# EAGLE design FiLFO (EAGLE 5.11)

## Sheet 1 of 2
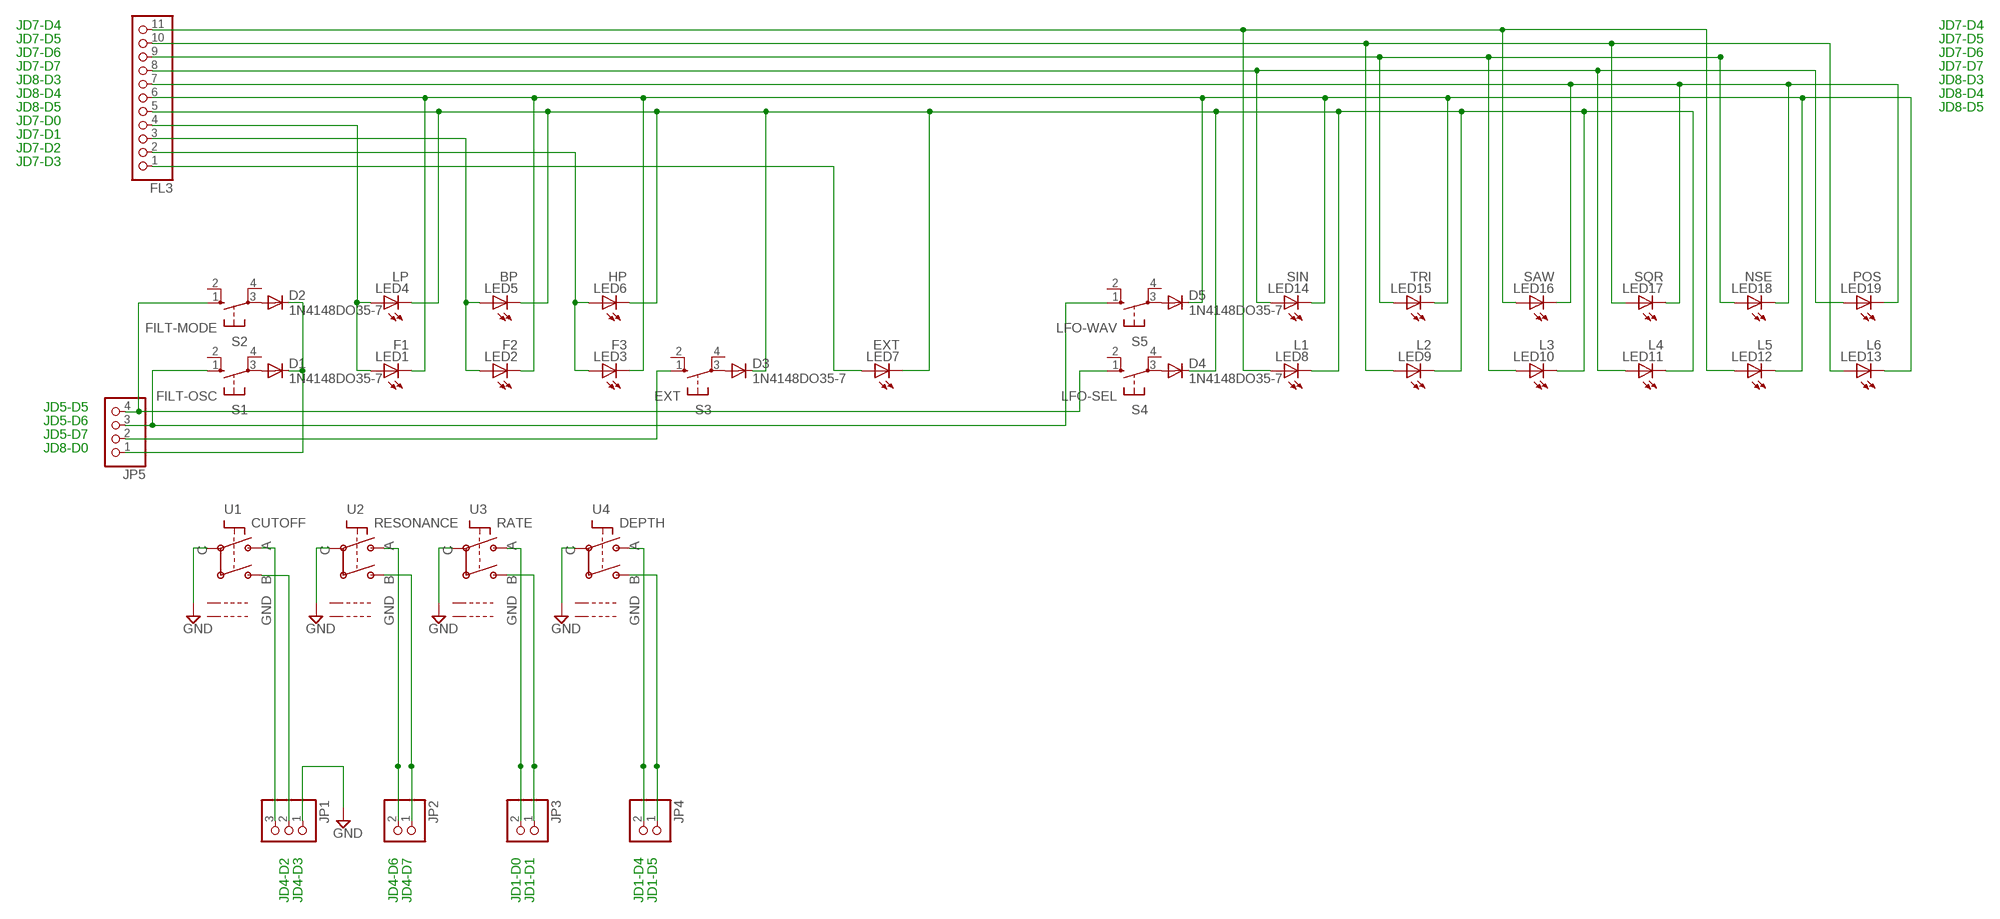
[diagram p0: schematic, sheet 1]

### Parts
D1  1N4148DO35-7  [DO35-7]
D2  1N4148DO35-7  [DO35-7]
D3  1N4148DO35-7  [DO35-7]
D4  1N4148DO35-7  [DO35-7]
D5  1N4148DO35-7  [DO35-7]
FL3  PINHD-1X11  [1X11]
JP1  PINHD-1X3  [1X03]
JP2  PINHD-1X2  [1X02]
JP3  PINHD-1X2  [1X02]
JP4  PINHD-1X2  [1X02]
JP5  PINHD-1X4  [1X04]
LED1  F1  LED3MM  [LED3MM]
LED2  F2  LED3MM  [LED3MM]
LED3  F3  LED3MM  [LED3MM]
LED4  LP  LED3MM  [LED3MM]
LED5  BP  LED3MM  [LED3MM]
LED6  HP  LED3MM  [LED3MM]
LED7  EXT  LED3MM  [LED3MM]
LED8  L1  LED3MM  [LED3MM]
LED9  L2  LED3MM  [LED3MM]
LED10  L3  LED3MM  [LED3MM]
LED11  L4  LED3MM  [LED3MM]
LED12  L5  LED3MM  [LED3MM]
LED13  L6  LED3MM  [LED3MM]
LED14  SIN  LED3MM  [LED3MM]
LED15  TRI  LED3MM  [LED3MM]
LED16  SAW  LED3MM  [LED3MM]
LED17  SQR  LED3MM  [LED3MM]
LED18  NSE  LED3MM  [LED3MM]
LED19  POS  LED3MM  [LED3MM]
S1  FILT-OSC  10-XX  [B3F-10XX]
S2  FILT-MODE  10-XX  [B3F-10XX]
S3  EXT  10-XX  [B3F-10XX]
S4  LFO-SEL  10-XX  [B3F-10XX]
S5  LFO-WAV  10-XX  [B3F-10XX]
U1  CUTOFF  ENC_ALPS_STEC16  [STEC16]
U2  RESONANCE  ENC_ALPS_STEC16  [STEC16]
U3  RATE  ENC_ALPS_STEC16  [STEC16]
U4  DEPTH  ENC_ALPS_STEC16  [STEC16]

### Nets
GND: JP1.1 U1.P$C U2.P$C U3.P$C U4.P$C
N$1: JP1.3 U1.P$A
N$2: JP1.2 U1.P$B
N$3: D2.A S2.3(P)
N$4: JP2.2 U2.P$A
N$5: JP2.1 U2.P$B
N$6: JP3.2 U3.P$A
N$7: JP3.1 U3.P$B
N$9: JP4.2 U4.P$A
N$10: JP4.1 U4.P$B
N$11: D1.A S1.3(P)
N$12: D4.A S4.3(P)
N$13: JP5.3 S1.1(S) S5.1(S)
N$14: D3.A S3.3(P)
N$15: JP5.4 S2.1(S) S4.1(S)
N$16: D1.C D2.C JP5.1
N$17: D5.C FL3.6 LED1.K(C) LED2.K(C) LED3.K(C) LED12.K(C) LED13.K(C) LED14.K(C) LED15.K(C)
N$18: D5.A S5.3(P)
N$21: FL3.11 LED8.A LED12.A LED16.A
N$22: FL3.10 LED9.A LED13.A LED17.A
N$23: FL3.9 LED10.A LED15.A LED18.A
N$24: D3.C D4.C FL3.5 LED4.K(C) LED5.K(C) LED6.K(C) LED7.K(C) LED8.K(C) LED9.K(C) LED10.K(C) LED11.K(C)
N$26: FL3.7 LED16.K(C) LED17.K(C) LED18.K(C) LED19.K(C)
N$27: FL3.8 LED11.A LED14.A LED19.A
N$28: FL3.3 LED2.A LED5.A
N$29: JP5.2 S3.1(S)
N$37: FL3.1 LED7.A
N$38: FL3.4 LED1.A LED4.A
N$40: FL3.2 LED3.A LED6.A
Unconnected: S1.2(S1) S1.4(P1) S2.2(S1) S2.4(P1) S3.2(S1) S3.4(P1) S4.2(S1) S4.4(P1) S5.2(S1) S5.4(P1) U1.P$GND1 U1.P$GND2 U2.P$GND1 U2.P$GND2 U3.P$GND1 U3.P$GND2 U4.P$GND1 U4.P$GND2

### Notes on the sheet
- JD7-D4 | JD7-D4
- JD7-D5 | JD7-D5
- JD7-D6 | JD7-D6
- JD7-D7 | JD7-D7
- JD8-D3 | JD8-D3
- JD8-D4 | JD8-D4
- JD8-D5 | JD8-D5
- JD7-D0
- JD7-D1
- JD7-D2
- JD7-D3
- JD5-D5
- JD5-D6
- JD5-D7
- JD8-D0
- JD4-D2 | JD4-D3 | JD4-D6 | JD4-D7 | JD1-D0 | JD1-D1 | JD1-D4 | JD1-D5

## Sheet 2 of 2

## Library data of the parts
D1-D5 = diode:1N4148: DIODE high speed (Philips)
FL3 = pinhead:PINHD-1X11: PIN HEADER
JP1 = pinhead:PINHD-1X3: PIN HEADER
JP2-JP4 = pinhead:PINHD-1X2: PIN HEADER
JP5 = pinhead:PINHD-1X4: PIN HEADER
LED1-LED19 = led:LED: LED OSRAM: - CHIPLED LG R971, LG N971, LY N971, LG Q971, LY Q971, LO R971, LY R971 LH N974, LH R974 LS Q976, LO Q976, LY Q976 LO Q996 - Hyper CHIPLED LW Q18S LB Q993, LB Q99A, LB R99A - SideLED LS A670, LO A670, LY A670, LG A670, LP A670 LB A673, LV A673, LT A673, LW A673 LH A674 LY A675 LS A676, LA A676, LO A676, LY A676, LW A676 LS A679, LY A679, LG A679 - Hyper Micro SIDELED® LS Y876, LA Y876, LO Y876, LY Y876 LT Y87S - SmartLED LW L88C, LW L88S LB L89C, LB L89S, LG L890 LS L89K, LO L89K, LY L89K LS L896, LA L896, LO L896, LY L896 - TOPLED LS T670, LO T670, LY T670, LG T670, LP T670 LSG T670, LSP T670, LSY T670, LOP T670, LYG T670 LG T671, LOG T671, LSG T671 LB T673, LV T673, LT T673, LW T673 LH T674 LS T676, LA T676, LO T676, LY T676, LB T676, LH T676, LSB T676, LW T676 LB T67C, LV T67C, LT T67C, LS T67K, LO T67K, LY T67K, LW E67C LS E67B, LA E67B, LO E67B, LY E67B, LB E67C, LV E67C, LT E67C LW T67C LS T679, LY T679, LG T679 LS T770, LO T770, LY T770, LG T770, LP T770 LB T773, LV T773, LT T773, LW T773 LH T774 LS E675, LA E675, LY E675, LS T675 LS T776, LA T776, LO T776, LY T776, LB T776 LHGB T686 LT T68C, LB T68C - Hyper Mini TOPLED® LB M676 - Mini TOPLED Santana® LG M470 LS M47K, LO M47K, LY M47K Source: http://www.osram.convergy.de LUXEON: - LUMILED® LXK2-PW12-R00, LXK2-PW12-S00, LXK2-PW14-U00, LXK2-PW14-V00 LXK2-PM12-R00, LXK2-PM12-S00, LXK2-PM14-U00 LXK2-PE12-Q00, LXK2-PE12-R00, LXK2-PE12-S00, LXK2-PE14-T00, LXK2-PE14-U00 LXK2-PB12-K00, LXK2-PB12-L00, LXK2-PB12-M00, LXK2-PB14-N00, LXK2-PB14-P00, LXK2-PB14-Q00 LXK2-PR12-L00, LXK2-PR12-M00, LXK2-PR14-Q00, LXK2-PR14-R00 LXK2-PD12-Q00, LXK2-PD12-R00, LXK2-PD12-S00 LXK2-PH12-R00, LXK2-PH12-S00 LXK2-PL12-P00, LXK2-PL12-Q00, LXK2-PL12-R00 Source: www.luxeon.com KINGBRIGHT: KA-3528ASYC Source: www.kingbright.com
S1-S5 = switch-omron:10-XX: OMRON SWITCH; MPN: B3F-1000; OC_FARNELL: 176432; OC_NEWARK: 36M3542
U1-U4 = encoder:ENC

## Board
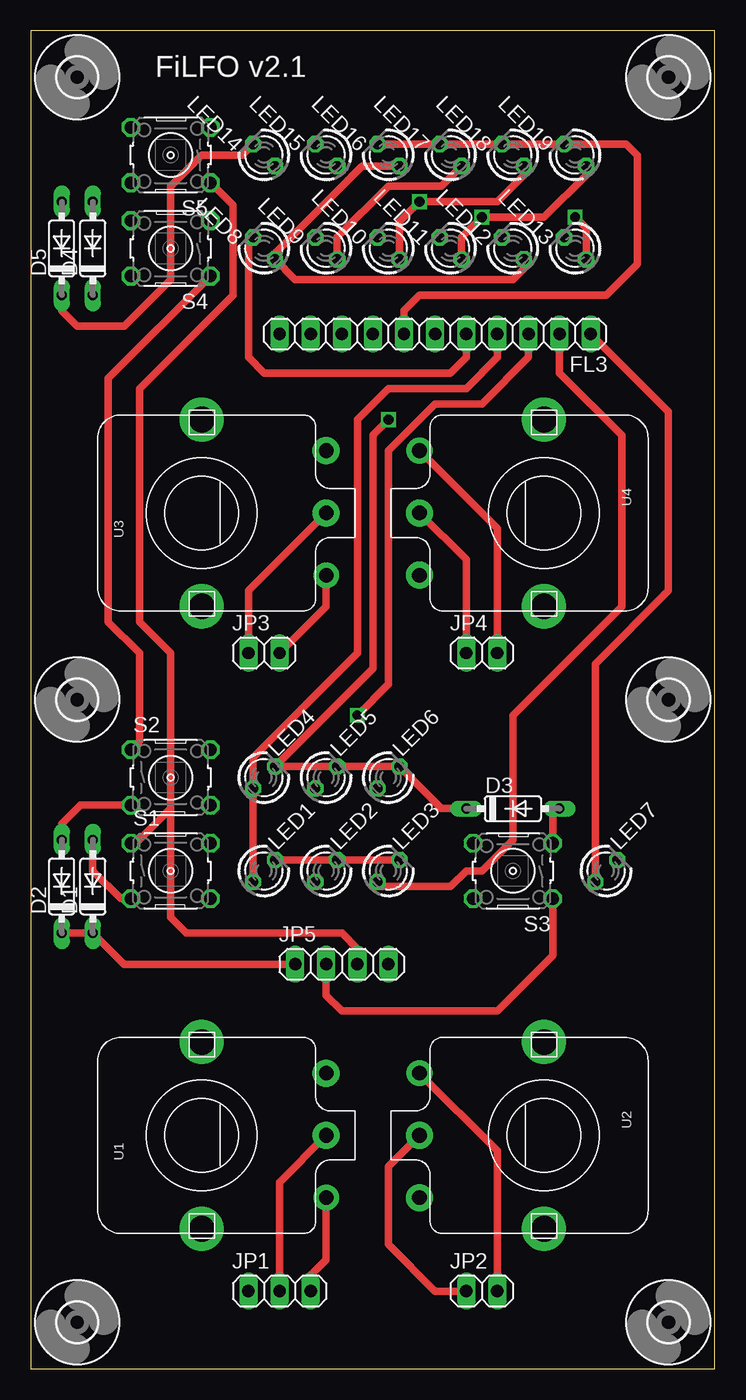
[diagram p1: board, top side]
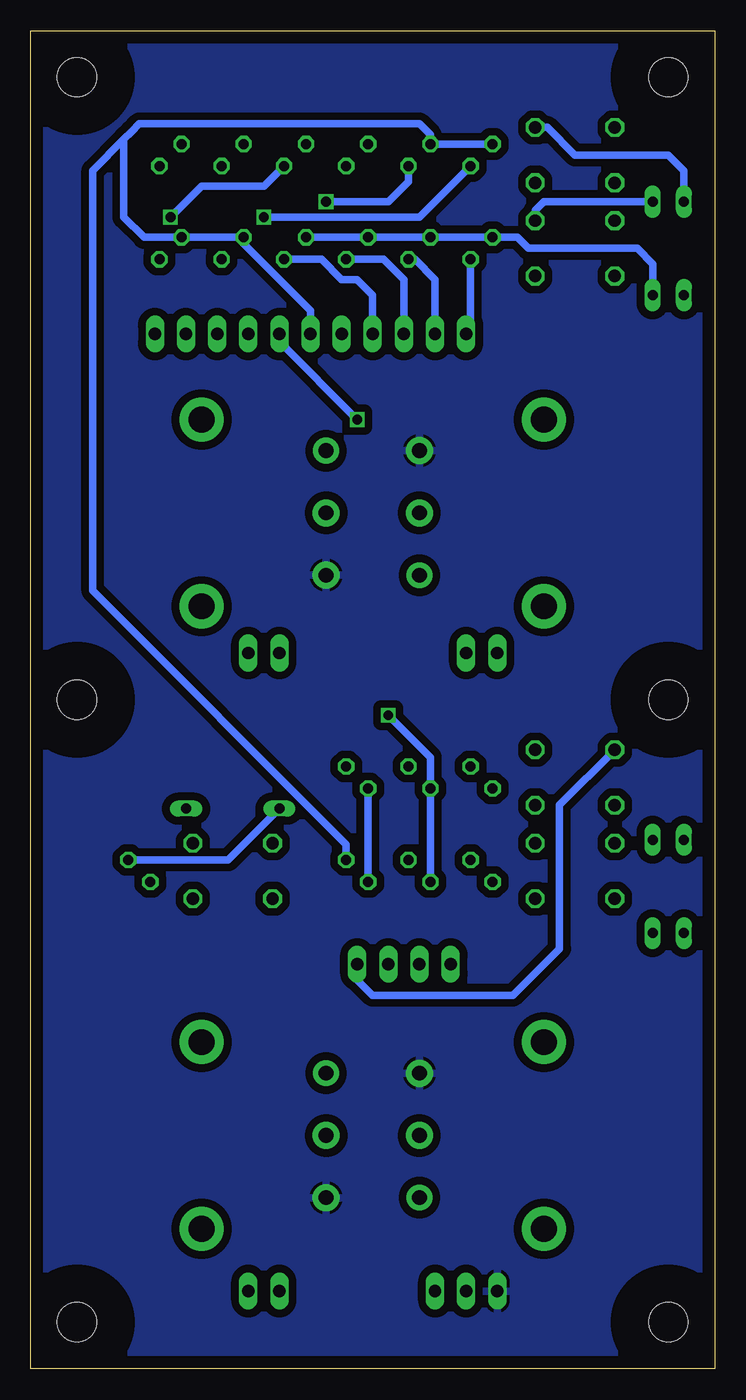
[diagram p2: board, bottom side, seen from below]

Size 55.87 x 109.21 mm. Coordinates in mm from the lower left corner, seen from the top.
Outline: 0,0 55.87,0 55.87,109.21 0,109.21 0,0
Copper layers (1*16): Top 0.035mm / dielectric 1.5mm / Bottom 0.035mm
Design rules "default": minimum track width 10mil, minimum drill 24mil, track to track 8mil, track to pad 8mil, pad to pad 8mil, via to via 8mil, smd to smd 8mil, copper to edge 40mil, drill to drill 8mil, minimum pad ring 10mil, minimum via ring 8mil, stop-mask expansion 4mil, vias tented up to drill 0mil, thermal gap 10mil

### Footprints (pad centres in the part's own frame; a part is rotated, then mirrored left to right if it is on the bottom)
DO35-7 = drill 0.813 long: A 3.81,0; C -3.81,0
1X11 = drill 1.016 long: 1 -12.7,0; 2 -10.16,0; 3 -7.62,0; 4 -5.08,0; 5 -2.54,0; 6 0,0; 7 2.54,0; 8 5.08,0; 9 7.62,0; 10 10.16,0; 11 12.7,0
1X03 = drill 1.016 long: 1 -2.54,0; 2 0,0; 3 2.54,0
1X02 = drill 1.016 long: 1 -1.27,0; 2 1.27,0
1X04 = drill 1.016 long: 1 -3.81,0; 2 -1.27,0; 3 1.27,0; 4 3.81,0
LED3MM = drill 0.813 octagon: A -1.27,0; K 1.27,0
B3F-10XX = drill 1.016 octagon: 1 -3.251,2.261; 2 3.251,2.261; 3 -3.251,-2.261; 4 3.251,-2.261
STEC16 = drill 1.2 pad 2.1 round: P$A -5.08,-10.16 | drill 1.2 pad 2.2 round: P$B 0,-10.16; P$C 5.08,-10.16 | drill 2.1 pad 3.6 round: P$GND1 -7.62,0; P$GND2 7.62,0
3,2 = hole 3.2: 0,0

### Placement (x,y rotation side)
D1  5.08,39.37 90 top
D2  2.54,39.37 90 top
D3  39.37,45.72 0 top
D4  5.08,91.44 90 top
D5  2.54,91.44 90 top
FL3  33.02,84.45 180 top
JP1  20.32,6.35 0 top
JP2  36.83,6.35 0 top
JP3  19.05,58.42 0 top
JP4  36.83,58.42 0 top
JP5  25.4,33.02 0 top
LED1  19.05,40.64 45 top
LED2  24.13,40.64 45 top
LED3  29.21,40.64 45 top
LED4  19.05,48.26 45 top
LED5  24.13,48.26 45 top
LED6  29.21,48.26 45 top
LED7  46.99,40.64 45 top
LED8  19.05,91.44 135 top
LED9  24.13,91.44 135 top
LED10  29.21,91.44 135 top
LED11  34.29,91.44 135 top
LED12  39.37,91.44 135 top
LED13  44.45,91.44 135 top
LED14  19.05,99.06 135 top
LED15  24.13,99.06 135 top
LED16  29.21,99.06 135 top
LED17  34.29,99.06 135 top
LED18  39.37,99.06 135 top
LED19  44.45,99.06 135 top
S1  11.43,40.64 0 top
S2  11.43,48.26 0 top
S3  39.37,40.64 180 top
S4  11.43,91.44 180 top
S5  11.43,99.06 180 top
U1  13.97,19.05 90 top
U2  41.91,19.05 270 top
U3  13.97,69.85 90 top
U4  41.91,69.85 270 top
U$1  [3,2]  3.81,3.81 0 top
U$2  [3,2]  52.07,3.81 0 top
U$3  [3,2]  3.81,105.41 0 top
U$4  [3,2]  52.07,105.41 0 top
U$5  [3,2]  3.81,54.61 0 top
U$6  [3,2]  52.07,54.61 0 top

### Tracks (layer width: path | path; a pad name or v marks a point on that pad's centre or on a via)
GND
  pour Bottom (isolate 0.635): 0,109.22 55.88,109.22 55.88,0 0,0
N$1
  Top 0.61: JP1.3 22.86,7.62 24.13,8.89 U1.P$A
N$2
  Top 0.61: JP1.2 20.32,15.24 U1.P$B
N$3
  Top 0.61: S2.3 4.09,46 2.54,44.45 D2.A
N$4
  Top 0.61: JP2.2 38.1,17.78 U2.P$A
N$5
  Top 0.61: JP2.1 33.02,6.35 29.21,10.16 29.21,16.51 U2.P$B
N$6
  Top 0.61: JP3.2 24.13,62.23 U3.P$A
N$7
  Top 0.61: JP3.1 17.78,63.5 U3.P$B
N$9
  Top 0.61: JP4.2 38.1,68.58 U4.P$A
N$10
  Top 0.61: JP4.1 35.56,66.04 U4.P$B
N$11
  Top 0.61: S1.3 7.34,38.38 5.08,40.64 D1.A
N$12
  Bottom 0.61: S4.3 14.68,94.54 13.97,95.25 D4.A
N$13
  Top 0.61: S5.1 16.51,94.97 16.51,87.63 8.89,80.01 8.89,60.96 11.43,58.42 11.43,45.72 | 11.43,45.72 11.43,36.83 12.7,35.56 25.4,35.56 26.67,34.29 JP5.3 | S1.1 8.61,42.9 11.43,45.72
N$14
  Top 0.61: S3.3 42.62,45.16 D3.A
N$15
  Top 0.61: S2.1 8.89,51.23 8.89,58.42 6.35,60.96 6.35,80.85 S4.1
  Bottom 0.61: S2.1 12.7,46 12.7,34.29 16.51,30.48 27.94,30.48 29.21,31.75 JP5.4
N$16
  Top 0.61: JP5.1 7.62,33.02 D1.C D2.C
N$17
  Top 0.61: LED1.K LED2.K LED3.K | LED14.K 17.25,99.06 13.97,99.06 11.43,96.52 11.43,88.9 7.62,85.09 3.81,85.09 2.54,86.36 D5.C
  Bottom 0.61: LED14.K LED15.K 23.23,100.7 24.13,101.6 46.99,101.6 47.62,100.97 48.26,100.33 | 48.26,100.33 48.26,93.98 46.62,92.34 LED13.K LED12.K 38.47,91.81 33.02,86.36 FL3.6 | LED3.K 30.11,42.81 50.8,63.5 50.8,97.79 48.26,100.33
N$18
  Bottom 0.61: S5.3 13.69,101.32 11.43,99.06 3.81,99.06 2.54,97.79 D5.A
N$21
  Top 0.61: LED12.A 40.27,89.8 39.37,88.9 21.59,88.9 LED8.A 19.95,91.07 27.04,98.16 LED16.A
  Bottom 0.61: LED8.A 19.95,84.83 FL3.11
N$22  (via drill 0.8)
  Top 0.61: LED9.A 25.03,92.34 29.21,96.52 33.55,96.52 LED17.A | LED13.A 45.35,93.08 v44.45,93.98
  Bottom 0.61: LED9.A 24.5,90.54 22.86,88.9 FL3.10 | LED17.A | LED17.A 36.83,96.52 41.91,96.52 v44.45,93.98
N$23  (via drill 0.8)
  Top 0.61: LED18.A 40.27,97.42 38.1,95.25 v31.75,95.25 30.11,93.61 LED10.A
  Bottom 0.61: LED10.A 27.04,90.54 25.4,88.9 FL3.9 | LED15.A 25.03,96.89 26.67,95.25 v31.75,95.25
N$24  (via drill 0.8)
  Top 0.61: D3.C 33.55,45.72 LED6.K LED5.K LED4.K 27.94,57.15 27.94,76.2 v29.21,77.47 | FL3.5 35.56,82.55 34.29,81.28 19.05,81.28 17.78,82.55 17.78,91.97 LED8.K
  Bottom 0.61: LED11.K LED10.K LED9.K LED8.K 16.14,92.34 15.24,91.44 6.35,91.44 5.08,90.17 D4.C | LED7.K 39.74,41.54 D3.C | FL3.5 35.56,83.82 v29.21,77.47
N$26
  Top 0.61: FL3.7 30.48,86.36 31.75,87.63 46.99,87.63 49.53,90.17 49.53,99.06 48.63,99.96 LED19.K LED18.K LED17.K LED16.K
N$27  (via drill 0.8)
  Top 0.61: LED19.A 45.35,97.42 41.91,93.98 v36.83,93.98 35.19,92.34 LED11.A
  Bottom 0.61: LED11.A 32.12,90.54 30.48,88.9 29.21,88.9 27.94,87.63 FL3.8 | LED14.A | LED14.A 24.13,93.98 v36.83,93.98
N$28  (via drill 0.8)
  Top 0.61: FL3.3 40.64,82.55 36.83,78.74 33.02,78.74 29.21,74.93 29.21,55.88 v26.67,53.34
  Bottom 0.61: LED2.A LED5.A 23.23,49.9 v26.67,53.34
N$29
  Top 0.61: JP5.2 24.13,30.48 25.4,29.21 38.1,29.21 42.62,33.73 S3.1
N$37
  Top 0.61: LED7.A 46.09,57.52 52.07,63.5 52.07,78.11 FL3.1
N$38
  Top 0.61: FL3.4 38.1,82.55 35.56,80.01 29.21,80.01 26.67,77.47 26.67,58.42 18.15,49.9 LED4.A LED1.A
N$40
  Top 0.61: LED3.A 28.68,39.37 34.29,39.37 35.56,40.64 36.83,40.64 39.37,43.18 39.37,53.34 48.26,62.23 48.26,76.2 43.18,81.28 FL3.2
  Bottom 0.61: LED3.A LED6.A

### Text on the board
tPlace: FiLFO v2.1